# Altium project DRV8303_devbrd.PrjPCB
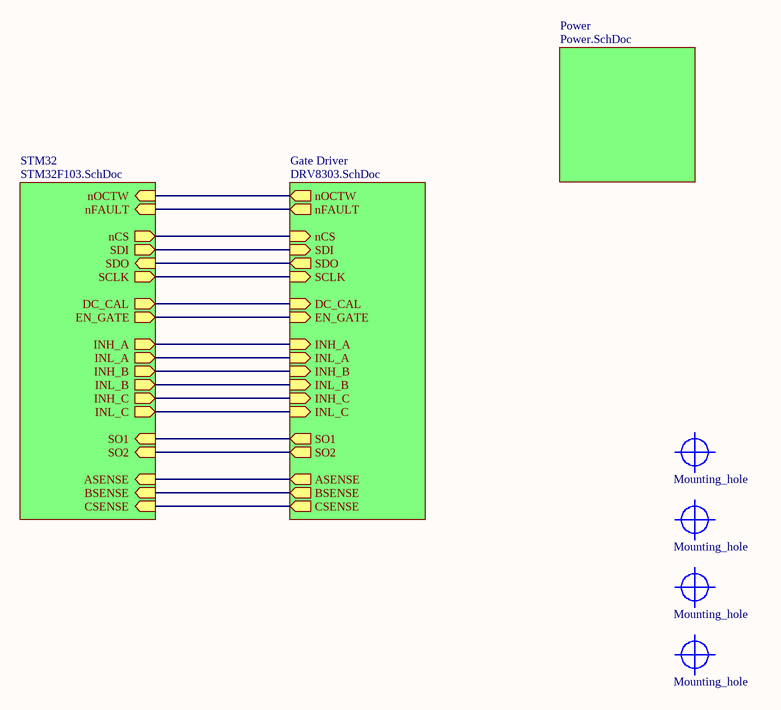
[diagram p0: TopLevel.SchDoc]
4 sheets, 83 parts. Net scope: hierarchical (ports join the sheet entries above them; power ports are global).
Board file: drv8303_brd.PcbDoc
Sheets:
  TopLevel.SchDoc
    STM32 = STM32F103.SchDoc
    Gate Driver = DRV8303.SchDoc
    Power = Power.SchDoc

## Sheet TopLevel.SchDoc
size A4; DocumentNumber: 1; SheetNumber: 1; SheetTotal: 4

### Parts
M1  Mounting_hole  [M3_drill]
M2  Mounting_hole  [M3_drill]
M3  Mounting_hole  [M3_drill]
M4  Mounting_hole  [M3_drill]

### Sub-sheets
Gate Driver = DRV8303.SchDoc: nOCTW (out), nCS (in), SDI (in), nFAULT (out), SDO (out), SCLK (in), DC_CAL (in), EN_GATE (in), INH_A (in), INL_A (in), INH_B (in), INL_B (in), INH_C (in), INL_C (in), SO1 (out), SO2 (out), CSENSE (out), ASENSE (out), BSENSE (out)
Power = Power.SchDoc: no entries
STM32 = STM32F103.SchDoc: nOCTW (in), nCS (out), SDI (out), nFAULT (in), SDO (in), SCLK (out), DC_CAL (out), EN_GATE (out), INH_A (out), INL_A (out), INH_B (out), INL_B (out), INH_C (out), INL_C (out), SO1 (in), SO2 (in), ASENSE (in), BSENSE (in), CSENSE (in)

### Nets
EN_GATE: sheet STM32/EN_GATE, sheet Gate Driver/EN_GATE
SPI1_MISO: sheet STM32/SDO, sheet Gate Driver/SDO
SPI1_MOSI: sheet STM32/SDI, sheet Gate Driver/SDI
SPI1_NSS: sheet STM32/nCS, sheet Gate Driver/nCS
SPI1_SCK: sheet STM32/SCLK, sheet Gate Driver/SCLK
TIM1_CH1: sheet STM32/INH_A, sheet Gate Driver/INH_A
TIM1_CH1N: sheet STM32/INL_A, sheet Gate Driver/INL_A
TIM1_CH2: sheet STM32/INH_B, sheet Gate Driver/INH_B
TIM1_CH2N: sheet STM32/INL_B, sheet Gate Driver/INL_B
TIM1_CH3: sheet STM32/INH_C, sheet Gate Driver/INH_C
TIM1_CH3N: sheet STM32/INL_C, sheet Gate Driver/INL_C
NetC12_1: sheet STM32/SO1, sheet Gate Driver/SO1
NetC13_1: sheet STM32/SO2, sheet Gate Driver/SO2
NetC21_1: sheet STM32/ASENSE, sheet Gate Driver/ASENSE
NetC22_1: sheet STM32/BSENSE, sheet Gate Driver/BSENSE
NetC23_1: sheet STM32/CSENSE, sheet Gate Driver/CSENSE
NetU1_1: sheet STM32/nOCTW, sheet Gate Driver/nOCTW
NetU1_2: sheet STM32/nFAULT, sheet Gate Driver/nFAULT
NetU1_8: sheet STM32/DC_CAL, sheet Gate Driver/DC_CAL

## Sheet STM32F103.SchDoc
size A4; DocumentNumber: 4; SheetNumber: 4; SheetTotal: 4
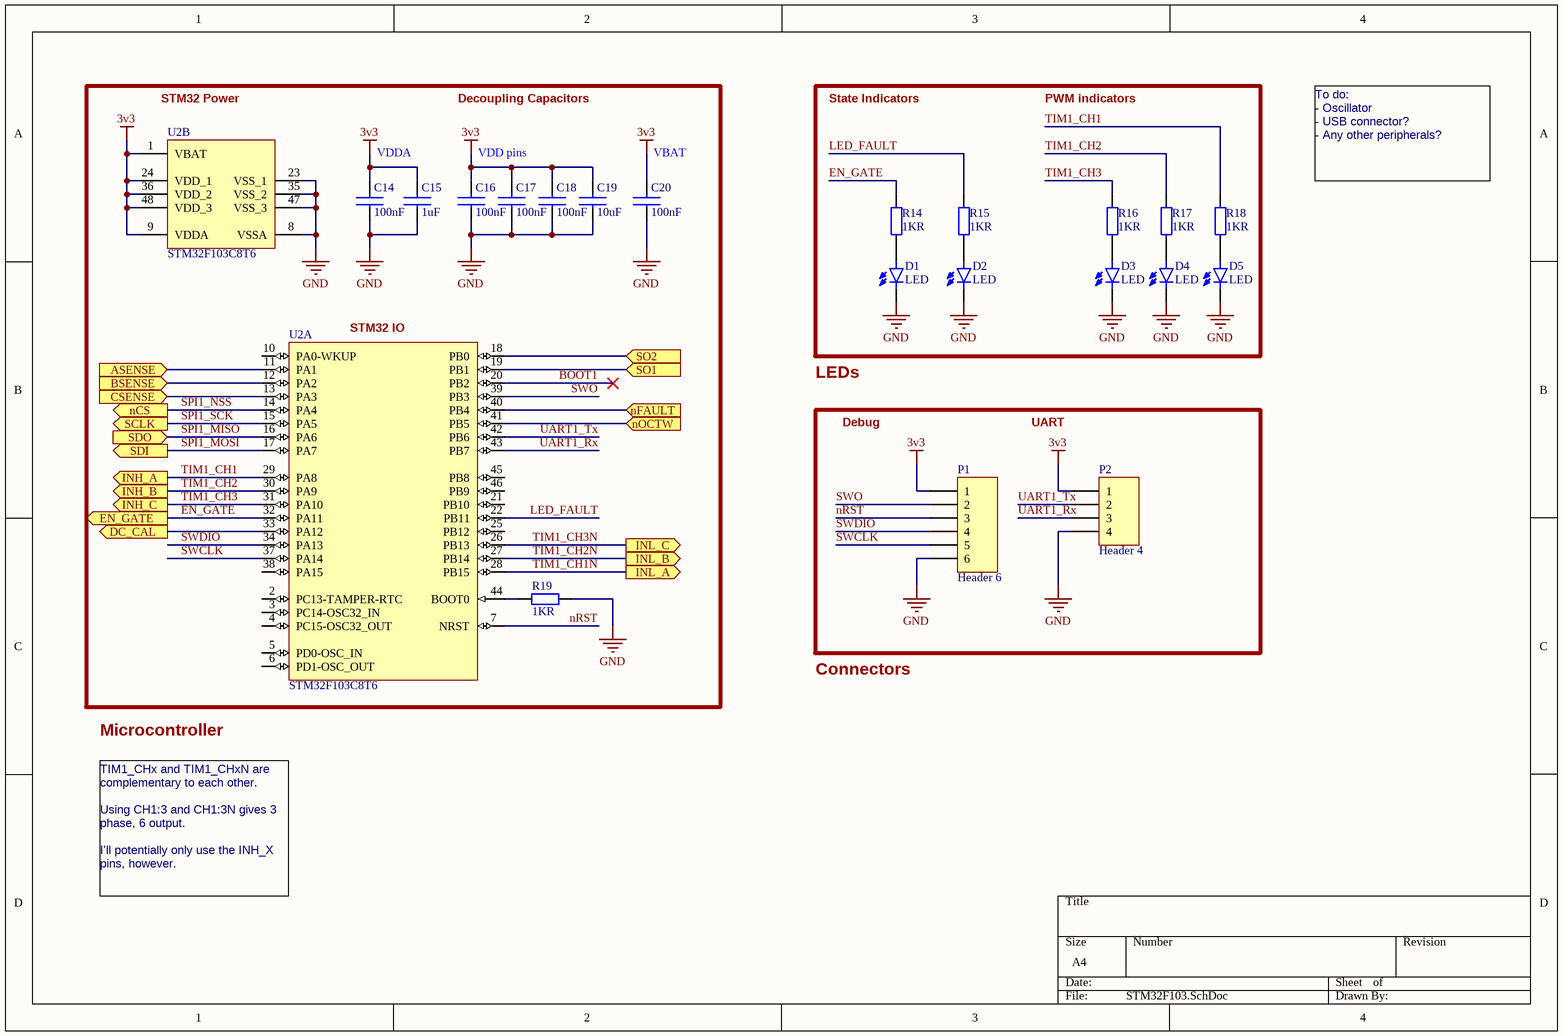
[diagram p1: STM32F103.SchDoc]

### Parts
C14  100nF  [RESC0603(1608)_N]
C15  1uF  [RESC0603(1608)_N]
C16  100nF  [RESC0603(1608)_N]
C17  100nF  [RESC0603(1608)_N]
C18  100nF  [RESC0603(1608)_N]
C19  10uF  [RESC0603(1608)_N]
C20  100nF  [RESC0603(1608)_N]
D1  LED  [0603]
D2  LED  [0603]
D3  LED  [0603]
D4  LED  [0603]
D5  LED  [0603]
P1  Header 6  [HDR1X6]
P2  Header 4  [HDR1X4]
R14  1KR  [RESC0603(1608)_N]
R15  1KR  [RESC0603(1608)_N]
R16  1KR  [RESC0603(1608)_N]
R17  1KR  [RESC0603(1608)_N]
R18  1KR  [RESC0603(1608)_N]
R19  1KR  [RESC0603(1608)_N]
U2  STM32F103C8T6  [STM-LQFP48_N]  (parts A,B of 2)

### Ports
ASENSE (in), BSENSE (in), CSENSE (in), DC_CAL (out), EN_GATE (out), INH_A (out), INH_B (out), INH_C (out), INL_A (out), INL_B (out), INL_C (out), nCS (out), nFAULT (in), nOCTW (in), SCLK (out), SDI (out), SDO (in), SO1 (in), SO2 (in)

### Nets
3v3: C14.2 C15.2 C16.2 C17.2 C18.2 C19.2 C20.2 P1.1 P2.1 U2.1(VBAT) U2.9(VDDA) U2.24(VDD_1) U2.36(VDD_2) U2.48(VDD_3)
GND: C14.1 C15.1 C16.1 C17.1 C18.1 C19.1 C20.1 D1.1 D2.1 D3.1 D4.1 D5.1 P1.6 P2.4 R19.2 U2.8(VSSA) U2.23(VSS_1) U2.35(VSS_2) U2.47(VSS_3)
BOOT1: U2.20(PB2)
EN_GATE: R14.1 U2.32(PA11) ; port EN_GATE
LED_FAULT: R15.1 U2.22(PB11)
nRST: P1.3 U2.7(NRST)
SPI1_MISO: U2.16(PA6) ; port SDO
SPI1_MOSI: U2.17(PA7) ; port SDI
SPI1_NSS: U2.14(PA4) ; port nCS
SPI1_SCK: U2.15(PA5) ; port SCLK
SWCLK: P1.5 U2.37(PA14)
SWDIO: P1.4 U2.34(PA13)
SWO: P1.2 U2.39(PB3)
TIM1_CH1: R18.1 U2.29(PA8) ; port INH_A
TIM1_CH1N: U2.28(PB15) ; port INL_A
TIM1_CH2: R17.1 U2.30(PA9) ; port INH_B
TIM1_CH2N: U2.27(PB14) ; port INL_B
TIM1_CH3: R16.1 U2.31(PA10) ; port INH_C
TIM1_CH3N: U2.26(PB13) ; port INL_C
UART1_Rx: P2.3 U2.43(PB7)
UART1_Tx: P2.2 U2.42(PB6)
NetC12_1: U2.19(PB1) ; port SO1
NetC13_1: U2.18(PB0) ; port SO2
NetC21_1: U2.11(PA1) ; port ASENSE
NetC22_1: U2.12(PA2) ; port BSENSE
NetC23_1: U2.13(PA3) ; port CSENSE
NetD1_2: D1.2 R14.2
NetD2_2: D2.2 R15.2
NetD3_2: D3.2 R16.2
NetD4_2: D4.2 R17.2
NetD5_2: D5.2 R18.2
NetR19_1: R19.1 U2.44(BOOT0)
NetU1_1: U2.41(PB5) ; port nOCTW
NetU1_2: U2.40(PB4) ; port nFAULT
NetU1_8: U2.33(PA12) ; port DC_CAL

Not connected (* = marked no-connect by the designer): U2 2(PC13-TAMPER-RTC) 3(PC14-OSC32_IN) 4(PC15-OSC32_OUT) 5(PD0-OSC_IN) 6(PD1-OSC_OUT) 10(PA0-WKUP) 21(PB10) 25(PB12) 38(PA15) 45(PB8) 46(PB9)

### Notes on the sheet
- (near U2) STM32 Power
- Decoupling Capacitors
- State Indicators
- PWM indicators
- VDDA
- VDD pins
- (near C20) VBAT
- To do:
  - Oscillator
  - USB connector?
  - Any other peripherals?
- (near U2) STM32 IO
- LEDs
- Debug
- UART
- Connectors
- Microcontroller
- TIM1_CHx and TIM1_CHxN are complementary to each other.
  Using CH1:3 and CH1:3N gives 3 phase, 6 output.
  I'll potentially only use the INH_X pins, however.

### Library data of the parts
C14-C20 = Capacitor: Non polarized capacitor; Manufacturer: *; Mounting Technology: Surface Mount; PartNumber: *; Digikey Part Number: *
P1 = Header 6: Header, 6-Pin; LatestRevisionDate: 17-Jul-2002; LatestRevisionNote: Re-released for DXP Platform.; Publisher: Altium Limited
P2 = Header 4: Header, 4-Pin; LatestRevisionDate: 17-Jul-2002; LatestRevisionNote: Re-released for DXP Platform.; Publisher: Altium Limited
R14-R19 = Resistor: ComponentLink1Description: Land patterns; ComponentLink1URL: https://www.vishay.com/docs/60119/landpatterns.pdf; PartNumber: *; Manufacturer: *; Mounting Technology: Surface Mount; Digikey Part Number: *; ComponentLink2Description: 1k digikey; ComponentLink2URL: https://www.digikey.com.au/product-detail/en/yageo/RC0603JR-071KL/311-1.0KGRCT-ND/729624; ComponentLink3Description: shunt digikey; ComponentLink3URL: https://www.digikey.com.au/product-detail/en/yageo/PF1206FRF070R02L/311-0.02AJCT-ND/2178365
U2 = STM32F103C8T6: ARM Cortex-M3 32-bit MCU, 64 KB Flash, 20 KB Internal RAM, 37 I/Os, 48-pin LQFP, -40 to 85 degC, Tray; A/D Converter: 2x12-bit (10 Channel); FLASH Size (Prog) (kB): 64; I/Os (High Current): 37; Internal RAM Size (kB): 20; Operating Frequency(F) (Processor speed) (MHz): 72; Supply Voltage(Vcc) min (V): 2; DatasheetVersion: Rev. 16; PackageVersion: Rev. 6, 06/2013; PackageReference: LQFP48; PackageDescription: 48-Pin Low Profile Quad Flat Package, 7 x 7 mm Body, 0.5 mm Pitch; Supplier 1: Digi-Key; Supplier Part Number 1: 497-6063-ND; Supplier 2: Farnell; Supplier Part Number 2: 1447637; Supplier 3: Newark; Supplier Part Number 3: 59M2182; Supplier 4: Newark; Supplier Part Number 4: 57P1222; Supplier 5: Mouser; Supplier Part Number 5: 511-STM32F103C8T6; Core: ARM Cortex-M3; Packing: Tray; Mounting Technology: Surface Mount; PartNumber: STM32F103C8T6; ComponentLink1Description: Manufacturer URL; ComponentLink1URL: http://www.st.com/web/en/home.html; ComponentLink2Description: Datasheet; ComponentLink2URL: http://www.st.com/st-web-ui/static/active/en/resource/technical/document/datasheet/CD00161566.pdf; ComponentLink3Description: Package Specification; ComponentLink3URL: http://www.st.com/st-web-ui/static/active/en/resource/technical/document/datasheet/DM00058181.pdf
D1-D5 = LED: PartNumber: *; Manufacturer: *; Mounting Technology: Surface Mount; Digikey Part Number: *

## Sheet DRV8303.SchDoc
size A3; DocumentNumber: 3; SheetNumber: 3; SheetTotal: 4
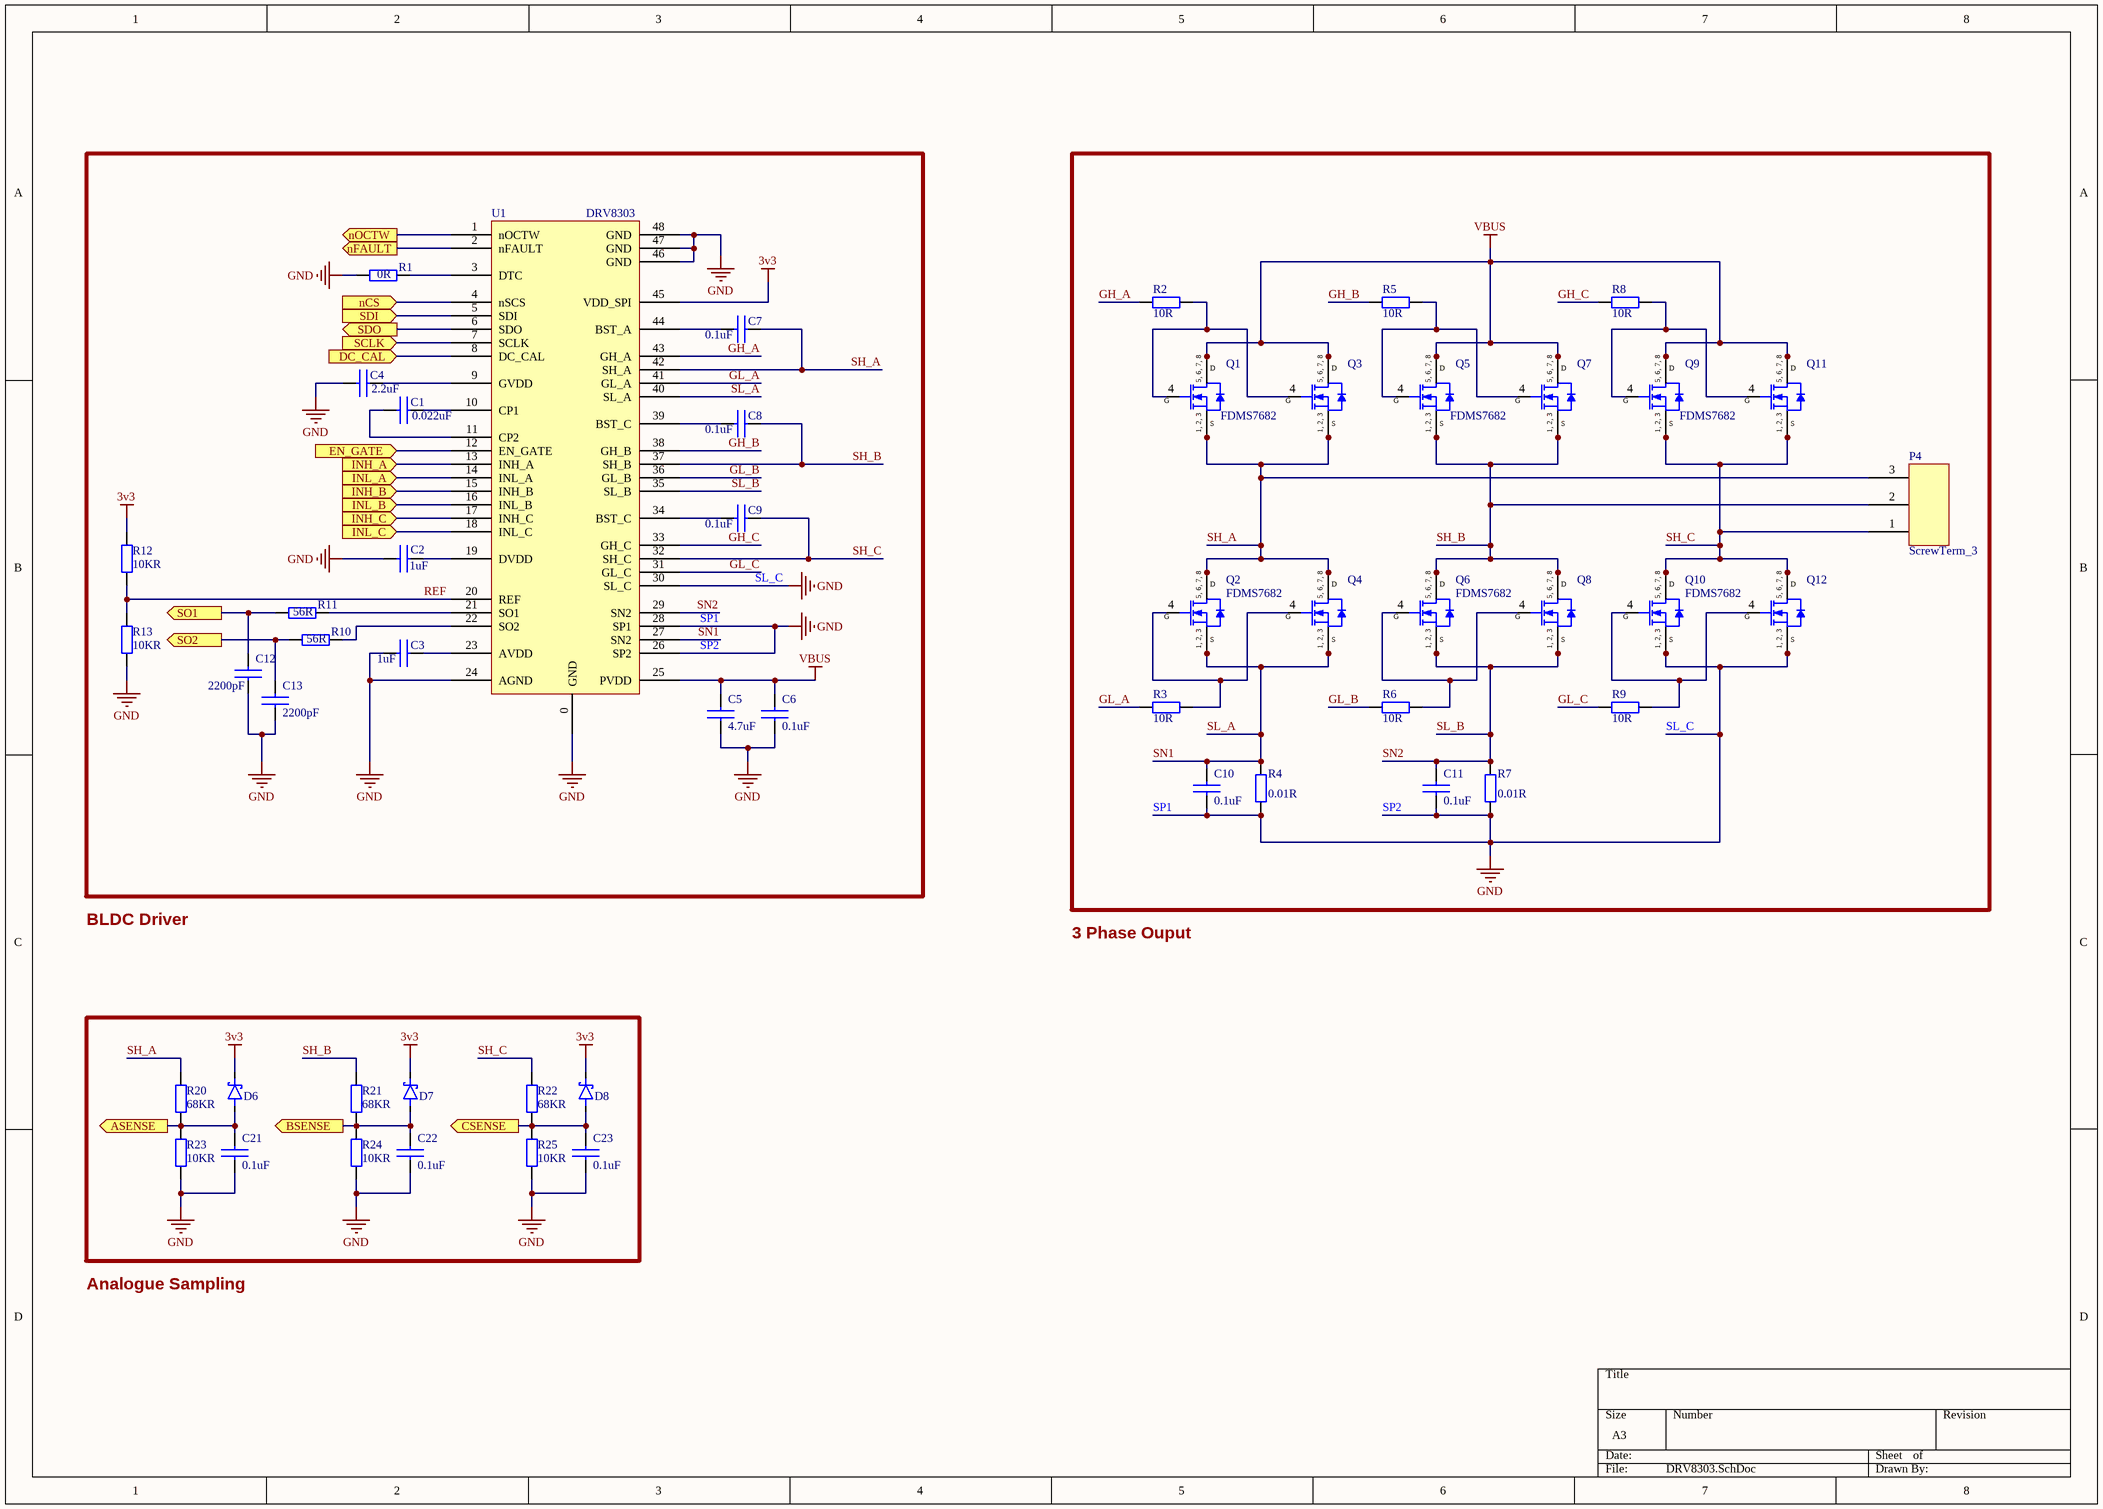
[diagram p2: DRV8303.SchDoc]

### Parts
C1  0.022uF  [RESC0603(1608)_N]
C2  1uF  [RESC0603(1608)_N]
C3  1uF  [RESC0603(1608)_N]
C4  2.2uF  [RESC0603(1608)_N]
C5  4.7uF  [RESC0603(1608)_N]
C6  0.1uF  [RESC0603(1608)_N]
C7  0.1uF  [RESC0603(1608)_N]
C8  0.1uF  [RESC0603(1608)_N]
C9  0.1uF  [RESC0603(1608)_N]
C10  0.1uF  [RESC0603(1608)_N]
C11  0.1uF  [RESC0603(1608)_N]
C12  2200pF  [RESC0603(1608)_N]
C13  2200pF  [RESC0603(1608)_N]
C21  0.1uF  [RESC0603(1608)_N]
C22  0.1uF  [RESC0603(1608)_N]
C23  0.1uF  [RESC0603(1608)_N]
D6  Diode_schottky  [SOD523]  (value not drawn)
D7  Diode_schottky  [SOD523]  (value not drawn)
D8  Diode_schottky  [SOD523]  (value not drawn)
P4  ScrewTerm_3  [ScrewTerm_3]
Q1  FDMS7682  [PQFN8_5x6]
Q2  FDMS7682  [PQFN8_5x6]
Q3  FDMS7682  [PQFN8_5x6]  (value not drawn)
Q4  FDMS7682  [PQFN8_5x6]  (value not drawn)
Q5  FDMS7682  [PQFN8_5x6]
Q6  FDMS7682  [PQFN8_5x6]
Q7  FDMS7682  [PQFN8_5x6]  (value not drawn)
Q8  FDMS7682  [PQFN8_5x6]  (value not drawn)
Q9  FDMS7682  [PQFN8_5x6]
Q10  FDMS7682  [PQFN8_5x6]
Q11  FDMS7682  [PQFN8_5x6]  (value not drawn)
Q12  FDMS7682  [PQFN8_5x6]  (value not drawn)
R1  0R  [RESC0603(1608)_N]
R2  10R  [RESC0603(1608)_N]
R3  10R  [RESC0603(1608)_N]
R4  0.01R  [RESC1206(3216)_M]
R5  10R  [RESC0603(1608)_N]
R6  10R  [RESC0603(1608)_N]
R7  0.01R  [RESC1206(3216)_M]
R8  10R  [RESC0603(1608)_N]
R9  10R  [RESC0603(1608)_N]
R10  56R  [RESC0603(1608)_N]
R11  56R  [RESC0603(1608)_N]
R12  10KR  [RESC0603(1608)_N]
R13  10KR  [RESC0603(1608)_N]
R20  68KR  [RESC0603(1608)_N]
R21  68KR  [RESC0603(1608)_N]
R22  68KR  [RESC0603(1608)_N]
R23  10KR  [RESC0603(1608)_N]
R24  10KR  [RESC0603(1608)_N]
R25  10KR  [RESC0603(1608)_N]
U1  DRV8303  [HSSOP48]

### Ports
ASENSE (out), BSENSE (out), CSENSE (out), DC_CAL (in), EN_GATE (in), INH_A (in), INH_B (in), INH_C (in), INL_A (in), INL_B (in), INL_C (in), nCS (in), nFAULT (out), nOCTW (out), SCLK (in), SDI (in), SDO (out), SO1 (out), SO2 (out)

### Nets
3v3: D6.1 D7.1 D8.1 R12.2 U1.45(VDD_SPI)
GND: C2.1 C3.1 C4.1 C5.2 C6.2 C10.2 C11.2 C12.2 C13.2 C21.2 C22.2 C23.2 Q10.1(S) Q10.2(S) Q10.3(S) Q12.1(S) Q12.2(S) Q12.3(S) R1.1 R4.2 R7.2 R13.1 R23.1 R24.1 R25.1 U1.0(GND) U1.24(AGND) U1.26(SP2) U1.28(SP1) U1.30(SL_C) U1.46(GND) U1.47(GND) U1.48(GND)
VBUS: C5.1 C6.1 Q1.0(D) Q1.5(D) Q1.6(D) Q1.7(D) Q1.8(D) Q3.0(D) Q3.5(D) Q3.6(D) Q3.7(D) Q3.8(D) Q5.0(D) Q5.5(D) Q5.6(D) Q5.7(D) Q5.8(D) Q7.0(D) Q7.5(D) Q7.6(D) Q7.7(D) Q7.8(D) Q9.0(D) Q9.5(D) Q9.6(D) Q9.7(D) Q9.8(D) Q11.0(D) Q11.5(D) Q11.6(D) Q11.7(D) Q11.8(D) U1.25(PVDD)
EN_GATE: U1.12(EN_GATE) ; port EN_GATE
GH_A: R2.1 U1.43(GH_A)
GH_B: R5.1 U1.38(GH_B)
GH_C: R8.1 U1.33(GH_C)
GL_A: R3.1 U1.41(GL_A)
GL_B: R6.1 U1.36(GL_B)
GL_C: R9.1 U1.31(GL_C)
REF: R12.1 R13.2 U1.20(REF)
SH_A: C7.2 P4.3 Q1.1(S) Q1.2(S) Q1.3(S) Q2.0(D) Q2.5(D) Q2.6(D) Q2.7(D) Q2.8(D) Q3.1(S) Q3.2(S) Q3.3(S) Q4.0(D) Q4.5(D) Q4.6(D) Q4.7(D) Q4.8(D) R20.2 U1.42(SH_A)
SH_B: C8.2 P4.2 Q5.1(S) Q5.2(S) Q5.3(S) Q6.0(D) Q6.5(D) Q6.6(D) Q6.7(D) Q6.8(D) Q7.1(S) Q7.2(S) Q7.3(S) Q8.0(D) Q8.5(D) Q8.6(D) Q8.7(D) Q8.8(D) R21.2 U1.37(SH_B)
SH_C: C9.2 P4.1 Q9.1(S) Q9.2(S) Q9.3(S) Q10.0(D) Q10.5(D) Q10.6(D) Q10.7(D) Q10.8(D) Q11.1(S) Q11.2(S) Q11.3(S) Q12.0(D) Q12.5(D) Q12.6(D) Q12.7(D) Q12.8(D) R22.2 U1.32(SH_C)
SL_A: C10.1 Q2.1(S) Q2.2(S) Q2.3(S) Q4.1(S) Q4.2(S) Q4.3(S) R4.1 U1.27(SN2) U1.40(SL_A)  [also labelled SN1]
SL_B: C11.1 Q6.1(S) Q6.2(S) Q6.3(S) Q8.1(S) Q8.2(S) Q8.3(S) R7.1 U1.29(SN2) U1.35(SL_B)  [also labelled SN2]
SPI1_MISO: U1.6(SDO) ; port SDO
SPI1_MOSI: U1.5(SDI) ; port SDI
SPI1_NSS: U1.4(nSCS) ; port nCS
SPI1_SCK: U1.7(SCLK) ; port SCLK
TIM1_CH1: U1.13(INH_A) ; port INH_A
TIM1_CH1N: U1.14(INL_A) ; port INL_A
TIM1_CH2: U1.15(INH_B) ; port INH_B
TIM1_CH2N: U1.16(INL_B) ; port INL_B
TIM1_CH3: U1.17(INH_C) ; port INH_C
TIM1_CH3N: U1.18(INL_C) ; port INL_C
NetC1_1: C1.1 U1.11(CP2)
NetC1_2: C1.2 U1.10(CP1)
NetC2_2: C2.2 U1.19(DVDD)
NetC3_2: C3.2 U1.23(AVDD)
NetC4_2: C4.2 U1.9(GVDD)
NetC7_1: C7.1 U1.44(BST_A)
NetC8_1: C8.1 U1.39(BST_C)
NetC9_1: C9.1 U1.34(BST_C)
NetC12_1: C12.1 R11.1 ; port SO1
NetC13_1: C13.1 R10.1 ; port SO2
NetC21_1: C21.1 D6.2 R20.1 R23.2 ; port ASENSE
NetC22_1: C22.1 D7.2 R21.1 R24.2 ; port BSENSE
NetC23_1: C23.1 D8.2 R22.1 R25.2 ; port CSENSE
NetQ1_4: Q1.4(G) Q3.4(G) R2.2
NetQ2_4: Q2.4(G) Q4.4(G) R3.2
NetQ5_4: Q5.4(G) Q7.4(G) R5.2
NetQ6_4: Q6.4(G) Q8.4(G) R6.2
NetQ9_4: Q9.4(G) Q11.4(G) R8.2
NetQ10_4: Q10.4(G) Q12.4(G) R9.2
NetR1_2: R1.2 U1.3(DTC)
NetR10_2: R10.2 U1.22(SO2)
NetR11_2: R11.2 U1.21(SO1)
NetU1_1: U1.1(nOCTW) ; port nOCTW
NetU1_2: U1.2(nFAULT) ; port nFAULT
NetU1_8: U1.8(DC_CAL) ; port DC_CAL

### Notes on the sheet
- SL_C
- SP1
- SP2
- (near R9) SL_C
- (near C10) SP1
- (near C11) SP2
- BLDC Driver
- 3 Phase Ouput
- Analogue Sampling
- (in symbol FDMS7682) 5, 6, 7, 8; 1, 2, 3

### Library data of the parts
C1-C13 C21-C23 = Capacitor: Non polarized capacitor; Manufacturer: *; Mounting Technology: Surface Mount; PartNumber: *; Digikey Part Number: *
R1-R13 R20-R25 = Resistor: ComponentLink1Description: Land patterns; ComponentLink1URL: https://www.vishay.com/docs/60119/landpatterns.pdf; PartNumber: *; Manufacturer: *; Mounting Technology: Surface Mount; Digikey Part Number: *; ComponentLink2Description: 1k digikey; ComponentLink2URL: https://www.digikey.com.au/product-detail/en/yageo/RC0603JR-071KL/311-1.0KGRCT-ND/729624; ComponentLink3Description: shunt digikey; ComponentLink3URL: https://www.digikey.com.au/product-detail/en/yageo/PF1206FRF070R02L/311-0.02AJCT-ND/2178365
  R4 R7: ClassName: pour_over
P4 = ScrewTerm_3: ClassName: pour_over
Q1-Q12 = FDMS7682: ClassName: pour_over

## Sheet Power.SchDoc
size A4; DocumentNumber: 2; SheetNumber: 2; SheetTotal: 4
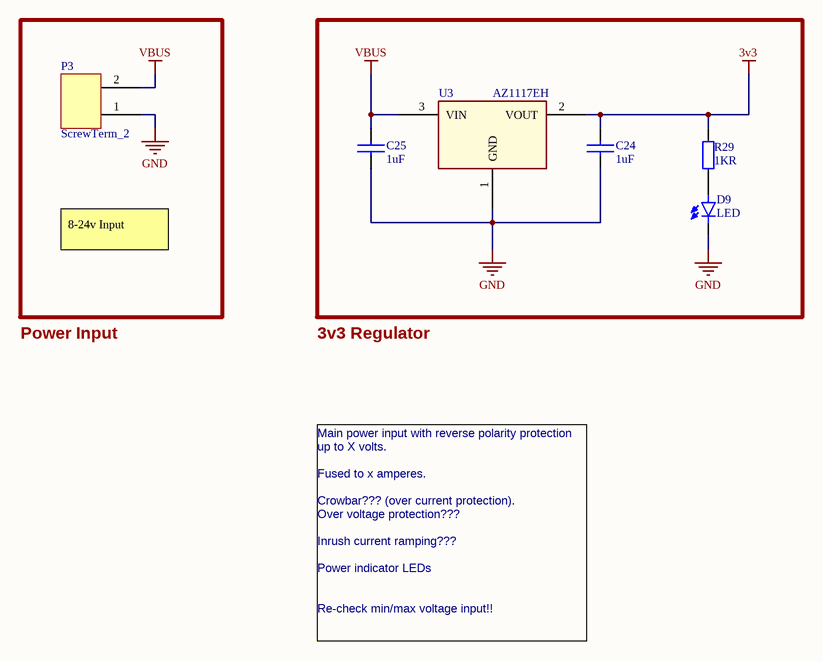
[diagram p3: Power.SchDoc]

### Parts
C24  1uF  [RESC0603(1608)_N]
C25  1uF  [RESC0603(1608)_N]
D9  LED  [0603]
P3  ScrewTerm_2  [ScrewTerm_2]
R29  1KR  [RESC0603(1608)_N]
U3  AZ1117EH  [SOT-223]

### Nets
3v3: C24.1 R29.1 U3.2(VOUT)
GND: C24.2 C25.2 D9.1 P3.1 U3.1(GND)
VBUS: C25.1 P3.2 U3.3(VIN)
NetD9_2: D9.2 R29.2

### Notes on the sheet
- 8-24v Input
- Power Input
- 3v3 Regulator
- Main power input with reverse polarity protection up to X volts.
  Fused to x amperes.
  Crowbar??? (over current protection).
  Over voltage protection???
  Inrush current ramping???
  Power indicator LEDs
  Re-check min/max voltage input!!

### Library data of the parts
C24 C25 = Capacitor: Non polarized capacitor; Manufacturer: *; Mounting Technology: Surface Mount; PartNumber: *; Digikey Part Number: *
R29 = Resistor: ComponentLink1Description: Land patterns; ComponentLink1URL: https://www.vishay.com/docs/60119/landpatterns.pdf; PartNumber: *; Manufacturer: *; Mounting Technology: Surface Mount; Digikey Part Number: *; ComponentLink2Description: 1k digikey; ComponentLink2URL: https://www.digikey.com.au/product-detail/en/yageo/RC0603JR-071KL/311-1.0KGRCT-ND/729624; ComponentLink3Description: shunt digikey; ComponentLink3URL: https://www.digikey.com.au/product-detail/en/yageo/PF1206FRF070R02L/311-0.02AJCT-ND/2178365
U3 = AZ1117EH: Manufacturer: Diodes Incorporated; PartNumber: AZ1117EH-3.3TRG1; ComponentLink1Description: Datasheet; ComponentLink1URL: https://www.diodes.com/assets/Datasheets/AZ1117E.pdf; Mounting Technology: Surface Mount; Digikey Part Number: AZ1117EH-3.3TRG1DICT-ND
D9 = LED: PartNumber: *; Manufacturer: *; Mounting Technology: Surface Mount; Digikey Part Number: *
P3 = ScrewTerm_2: ClassName: pour_over

## Nets that join several sheets
3v3: STM32F103 (14 pins), DRV8303 (5 pins), Power (C24.1 R29.1 U3.2)
GND: STM32F103 (19 pins), DRV8303 (33 pins), Power (5 pins)
VBUS: DRV8303 (33 pins), Power (C25.1 P3.2 U3.3)
EN_GATE: STM32F103 (R14.1 U2.32), DRV8303 (U1.12)
NetC12_1: STM32F103 (U2.19), DRV8303 (C12.1 R11.1)
NetC13_1: STM32F103 (U2.18), DRV8303 (C13.1 R10.1)
NetC21_1: STM32F103 (U2.11), DRV8303 (C21.1 D6.2 R20.1 R23.2)
NetC22_1: STM32F103 (U2.12), DRV8303 (C22.1 D7.2 R21.1 R24.2)
NetC23_1: STM32F103 (U2.13), DRV8303 (C23.1 D8.2 R22.1 R25.2)
NetU1_1: STM32F103 (U2.41), DRV8303 (U1.1)
NetU1_2: STM32F103 (U2.40), DRV8303 (U1.2)
NetU1_8: STM32F103 (U2.33), DRV8303 (U1.8)
SPI1_MISO: STM32F103 (U2.16), DRV8303 (U1.6)
SPI1_MOSI: STM32F103 (U2.17), DRV8303 (U1.5)
SPI1_NSS: STM32F103 (U2.14), DRV8303 (U1.4)
SPI1_SCK: STM32F103 (U2.15), DRV8303 (U1.7)
TIM1_CH1: STM32F103 (R18.1 U2.29), DRV8303 (U1.13)
TIM1_CH1N: STM32F103 (U2.28), DRV8303 (U1.14)
TIM1_CH2: STM32F103 (R17.1 U2.30), DRV8303 (U1.15)
TIM1_CH2N: STM32F103 (U2.27), DRV8303 (U1.16)
TIM1_CH3: STM32F103 (R16.1 U2.31), DRV8303 (U1.17)
TIM1_CH3N: STM32F103 (U2.26), DRV8303 (U1.18)